# EAGLE design DVD (EAGLE 7.3.0)
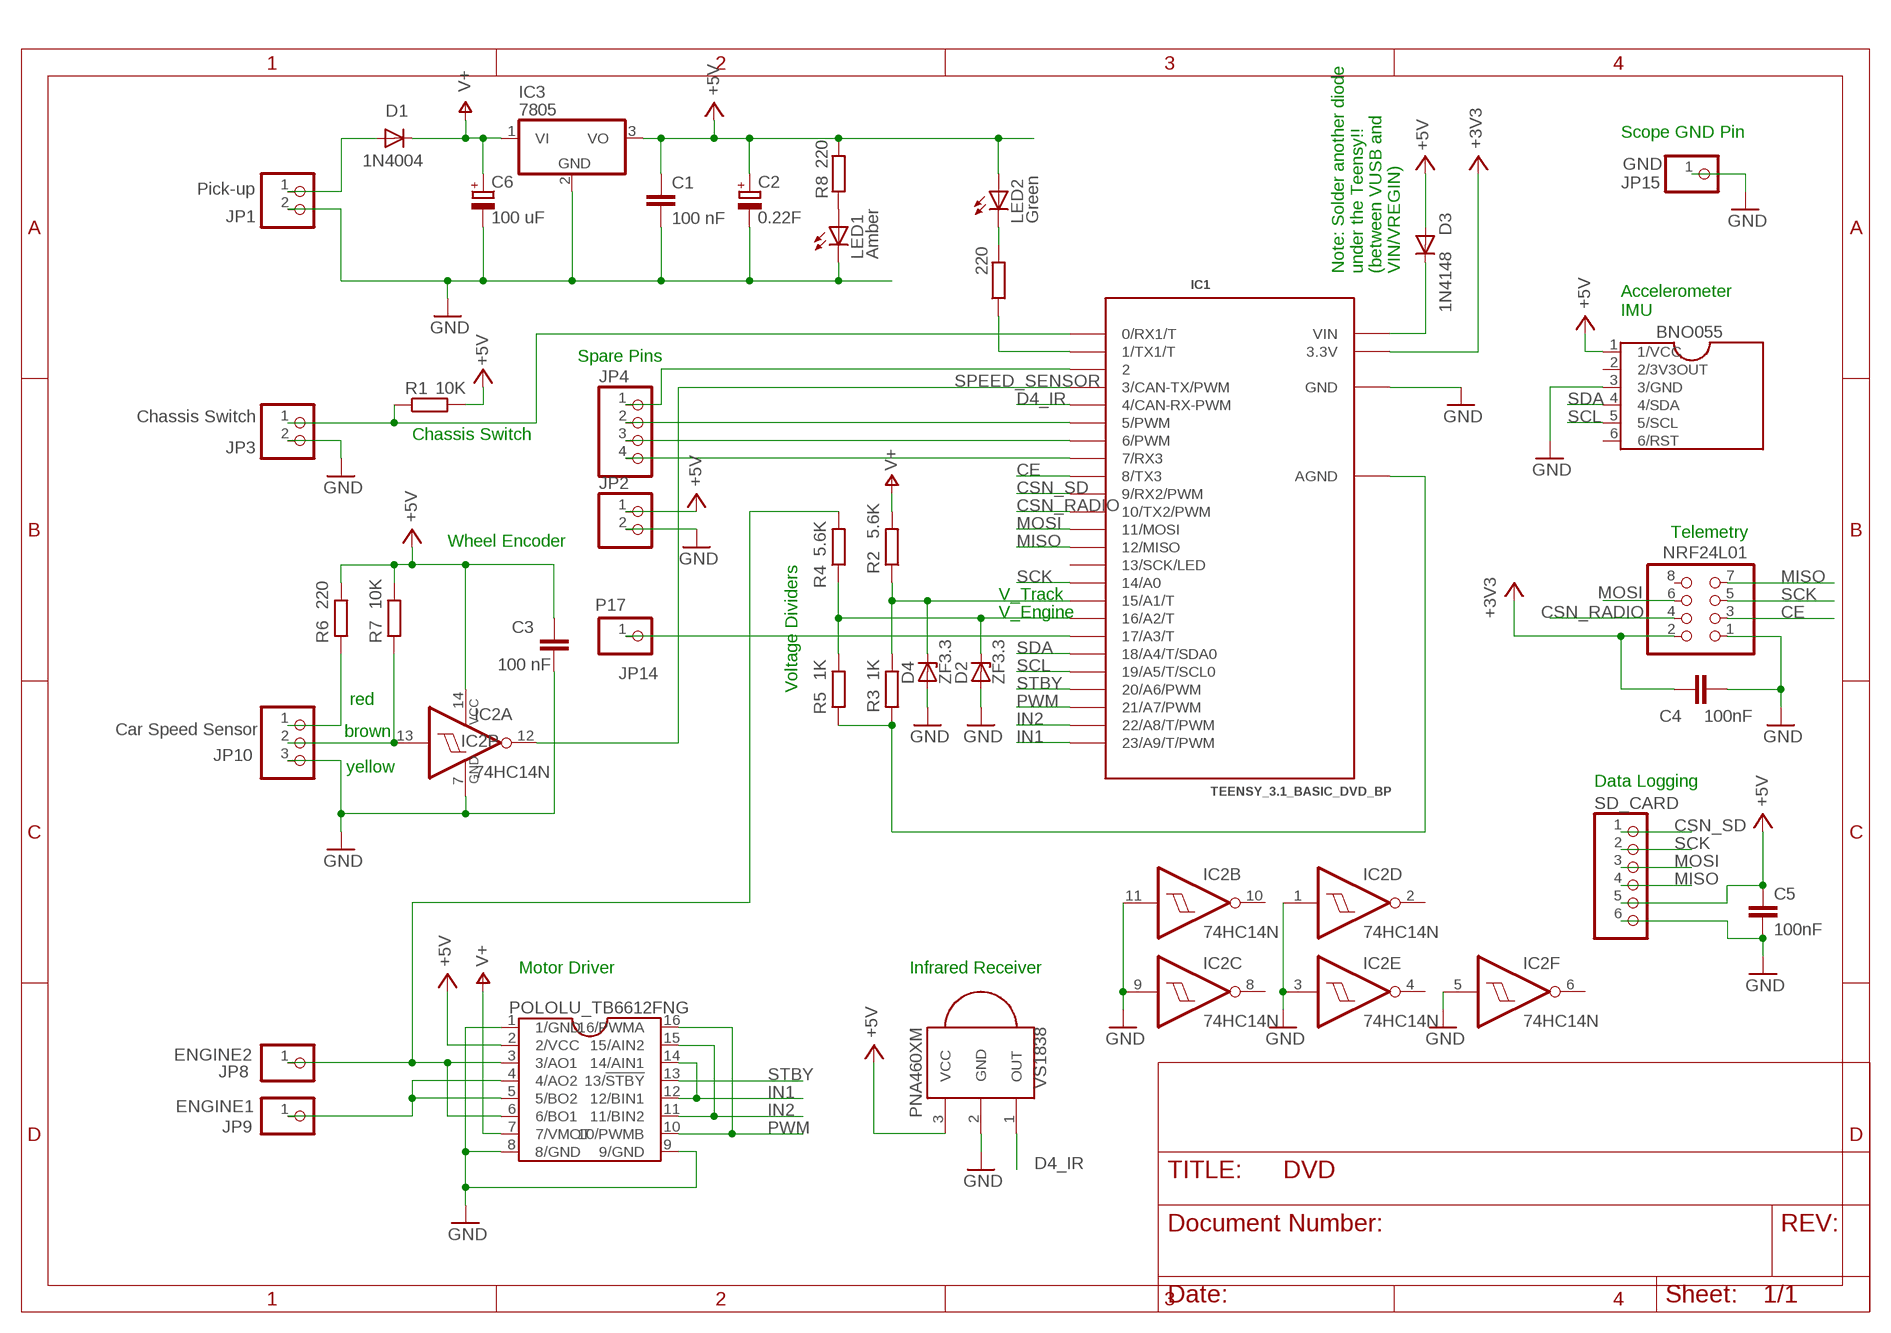
[diagram p0: schematic, sheet 1]

## Parts
BNO055  BNO055_LIGHT  [DIL12-6-0]
C1  100 nF  C-EU025-025X050  [C025-025X050]
C2  0.22F  CPOL-EUP128-50  [P128-50]
C3  100 nF  C-EU025-025X050  [C025-025X050]
C4  100nF  C-EU025-025X050  [C025-025X050]
C5  100nF  C-EU025-024X044  [C025-024X044]
C6  100 uF  CPOL-EUE2.5-6  [E2,5-6]
D1  1N4004  [DO41-10]
D2  ZF3.3  ZENER-DIODEZD-7.5  [ZDIO-7.5]
D3  1N4148  1N4004  [DO41-10]
D4  ZF3.3  ZENER-DIODEZD-7.5  [ZDIO-7.5]
IC1  TEENSY_3.1_BASIC_DVD_BP  [TEENSY_3.1_BASIC_DVD_BIGPADS]
IC2  74HC14N  [DIL14]
IC3  7805  786TV  [TO220V]
IC4  POLOLU_TB6612FNG  [DIL16WIDE]
JP1  Pick-up  PINHD-1X2  [1X02]
JP2  PINHD-1X2  [1X02]
JP3  Chassis Switch  PINHD-1X2  [1X02]
JP4  PINHD-1X4  [1X04]
JP8  ENGINE2  PINHD-1X1  [1X01]
JP9  ENGINE1  PINHD-1X1  [1X01]
JP10  Car Speed Sensor  PINHD-1X3  [1X03]
JP14  P17  PINHD-1X1  [1X01]
JP15  GND  PINHD-1X1  [1X01]
LED1  Amber  LED3MM  [LED3MM]
LED2  Green  LED3MM  [LED3MM]
NRF24L01  PINHD-2X4  [2X04]
R1  10K  R-EU_0207/10  [0207/10]
R2  5.6K  R-EU_0207/10  [0207/10]
R3  1K  R-EU_0207/10  [0207/10]
R4  5.6K  R-EU_0207/10  [0207/10]
R5  1K  R-EU_0207/10  [0207/10]
R6  220  R-EU_0207/10  [0207/10]
R7  10K  R-EU_0207/10  [0207/10]
R8  220  R-EU_0207/10  [0207/10]
R9  220  R-EU_0207/10  [0207/10]
SD_CARD  PINHD-1X6  [1X06]
VS1838  PNA460XM  [PNA460XM]

## Nets
+3V3: C4.1 IC1.3.3V NRF24L01.2
+5V: BNO055.1(1/VCC) C1.1 C2.+ C3.1 C5.1 D3.A IC2.14(P:VCC) IC3.3(VO) IC4.2(2/VCC) JP2.1 LED2.A R1.2 R6.2 R7.2 R8.2 SD_CARD.5 VS1838.3(VCC)
AGND: IC1.AGND R3.1 R5.1
CE: IC1.8(8/TX3) NRF24L01.3
CSN_RADIO: IC1.10(10/TX2/PWM) NRF24L01.4
CSN_SD: IC1.9(9/RX2/PWM) SD_CARD.1
D4_IR: IC1.4(4/CAN-RX-PWM) VS1838.1(OUT)
ENGINE1: IC4.4(4/AO2) IC4.5(5/BO2) JP9.1
GND: BNO055.3(3/GND) C1.2 C2.- C3.2 C4.2 C5.2 C6.- D2.A D4.A IC1.GND IC2.1(D:I) IC2.3(E:I) IC2.5(F:I) IC2.7(P:GND) IC2.9(C:I) IC2.11(B:I) IC3.2(GND) IC4.1(1/GND) IC4.8(8/GND) IC4.9(9/GND) JP1.2 JP2.2 JP3.2 JP10.3 JP15.1 LED1.K(C) NRF24L01.1 SD_CARD.6 VS1838.2(GND)
IN1: IC1.23/A9(23/A9/T/PWM) IC4.12(12/BIN1) IC4.14(14/AIN1)
IN2: IC1.22/A8(22/A8/T/PWM) IC4.11(11/BIN2) IC4.15(15/AIN2)
JP8: IC4.3(3/AO1) IC4.6(6/BO1) JP8.1 R4.2
MISO: IC1.12(12/MISO) NRF24L01.7 SD_CARD.4
MOSI: IC1.11(11/MOSI) NRF24L01.6 SD_CARD.3
N$1: D3.C IC1.VIN
N$2: JP10.1 R6.1
N$3: IC1.5(5/PWM) JP4.2
N$4: LED2.K(C) R9.2
N$6: IC1.17/A3(17/A3/T) JP14.1
N$7: LED1.A R8.1
N$10: D4.C IC1.15/A1(15/A1/T) R2.1 R3.2
N$11: D2.C IC1.16/A2(16/A2/T) R4.1 R5.2
N$18: IC1.0(0/RX1/T) JP3.1 R1.1
N$19: IC1.1(1/TX1/T) R9.1
N$20: IC1.2 JP4.1
N$21: IC1.6(6/PWM) JP4.3
N$22: IC1.7(7/RX3) JP4.4
N$26: IC2.13(A:I) JP10.2 R7.1
PICKUP_PLUS: D1.A JP1.1
PWM: IC1.21/A7(21/A7/PWM) IC4.10(10/PWMB) IC4.16(16/PWMA)
SCK: IC1.14/A0 NRF24L01.5 SD_CARD.2
SCL: BNO055.5(5/SCL) IC1.19/A5(19/A5/T/SCL0)
SDA: BNO055.4(4/SDA) IC1.18/A4(18/A4/T/SDA0)
SPEED_SENSOR: IC1.3(3/CAN-TX/PWM) IC2.12(A:O)
STBY: IC1.20/A6(20/A6/PWM) IC4.13(13/!STBY)
V+: C6.+ D1.C IC3.1(VI) IC4.7(7/VMOT) R2.2
Unconnected: BNO055.6(6/RST) IC1.13(13/SCK/LED) IC2.2(D:O) IC2.4(E:O) IC2.6(F:O) IC2.8(C:O) IC2.10(B:O) NRF24L01.8

## Notes on the sheet
- Scope GND Pin
- Note: Solder another diode
  under the Teensy!!
  (between VUSB and
  VIN/VREGIN)
- Accelerometer
  IMU
- Spare Pins
- Chassis Switch
- Telemetry
- Wheel Encoder
- Voltage Dividers
- V_Track
- V_Engine
- red
- brown
- yellow
- Data Logging
- Motor Driver | Infrared Receiver

## Power pins joined to a net without a drawn wire
2/3V3OUT: BNO055.2(2/3V3OUT)

## Library data of the parts
BNO055 = DVD:BNO055_LIGHT
C1 C3 C4 = resistor:C-EU: CAPACITOR, European symbol
C2 = resistor:CPOL-EU: POLARIZED CAPACITOR, European symbol
C5 = rcl:C-EU: CAPACITOR, European symbol
C6 = rcl:CPOL-EU: POLARIZED CAPACITOR, European symbol
D1 D3 = adafruit:1N4004: DIODE General purpose 1N400x type rectifier (With bigger pads) http://www.ladyada.net/library/pcb/eaglelibrary.html
D2 D4 = diode:ZENER-DIODE: Z-Diode
IC1 = Teensy_3_Series_Board_v1.0:TEENSY_3.1_BASIC_DVD_BP
IC2 = 74xx-eu:74*14: Hex schmitt trigger INVERTER
IC3 = linear:78*: Positive VOLTAGE REGULATOR Source: http://cache.national.com/ds/LM/LM78L05.pdf http://www.fairchildsemi.com/ds/LM/LM7805.pdf
IC4 = DVD:POLOLU_TB6612FNG
JP1-JP3 = pinhead:PINHD-1X2: PIN HEADER
JP4 = pinhead:PINHD-1X4: PIN HEADER
JP8 JP9 JP14 JP15 = pinhead:PINHD-1X1: PIN HEADER
JP10 = pinhead:PINHD-1X3: PIN HEADER
LED1 LED2 = adafruit:LED: LED OSRAM: - CHIPLED LG R971, LG N971, LY N971, LG Q971, LY Q971, LO R971, LY R971 LH N974, LH R974 LS Q976, LO Q976, LY Q976 LO Q996 - Hyper CHIPLED LW Q18S LB Q993, LB Q99A, LB R99A - SideLED LS A670, LO A670, LY A670, LG A670, LP A670 LB A673, LV A673, LT A673, LW A673 LH A674 LY A675 LS A676, LA A676, LO A676, LY A676, LW A676 LS A679, LY A679, LG A679 - Hyper Micro SIDELED® LS Y876, LA Y876, LO Y876, LY Y876 LT Y87S - SmartLED LW L88C, LW L88S LB L89C, LB L89S, LG L890 LS L89K, LO L89K, LY L89K LS L896, LA L896, LO L896, LY L896 - TOPLED LS T670, LO T670, LY T670, LG T670, LP T670 LSG T670, LSP T670, LSY T670, LOP T670, LYG T670 LG T671, LOG T671, LSG T671 LB T673, LV T673, LT T673, LW T673 LH T674 LS T676, LA T676, LO T676, LY T676, LB T676, LH T676, LSB T676, LW T676 LB T67C, LV T67C, LT T67C, LS T67K, LO T67K, LY T67K, LW E67C LS E67B, LA E67B, LO E67B, LY E67B, LB E67C, LV E67C, LT E67C LW T67C LS T679, LY T679, LG T679 LS T770, LO T770, LY T770, LG T770, LP T770 LB T773, LV T773, LT T773, LW T773 LH T774 LS E675, LA E675, LY E675, LS T675 LS T776, LA T776, LO T776, LY T776, LB T776 LHGB T686 LT T68C, LB T68C - Hyper Mini TOPLED® LB M676 - Mini TOPLED Santana® LG M470 LS M47K, LO M47K, LY M47K Source: http://www.osram.convergy.de/
NRF24L01 = adafruit:PINHD-2X4: PIN HEADER
R1-R9 = resistor:R-EU_: RESISTOR, European symbol
SD_CARD = adafruit:PINHD-1X6: PIN HEADER
VS1838 = adafruit:PNA460XM: IR 38KHz receiver PNA4602 and related receivers http://www.ladyada.net/library/pcb/eaglelibrary.html

## Net classes
0 default: width 0.254 mm

## Board
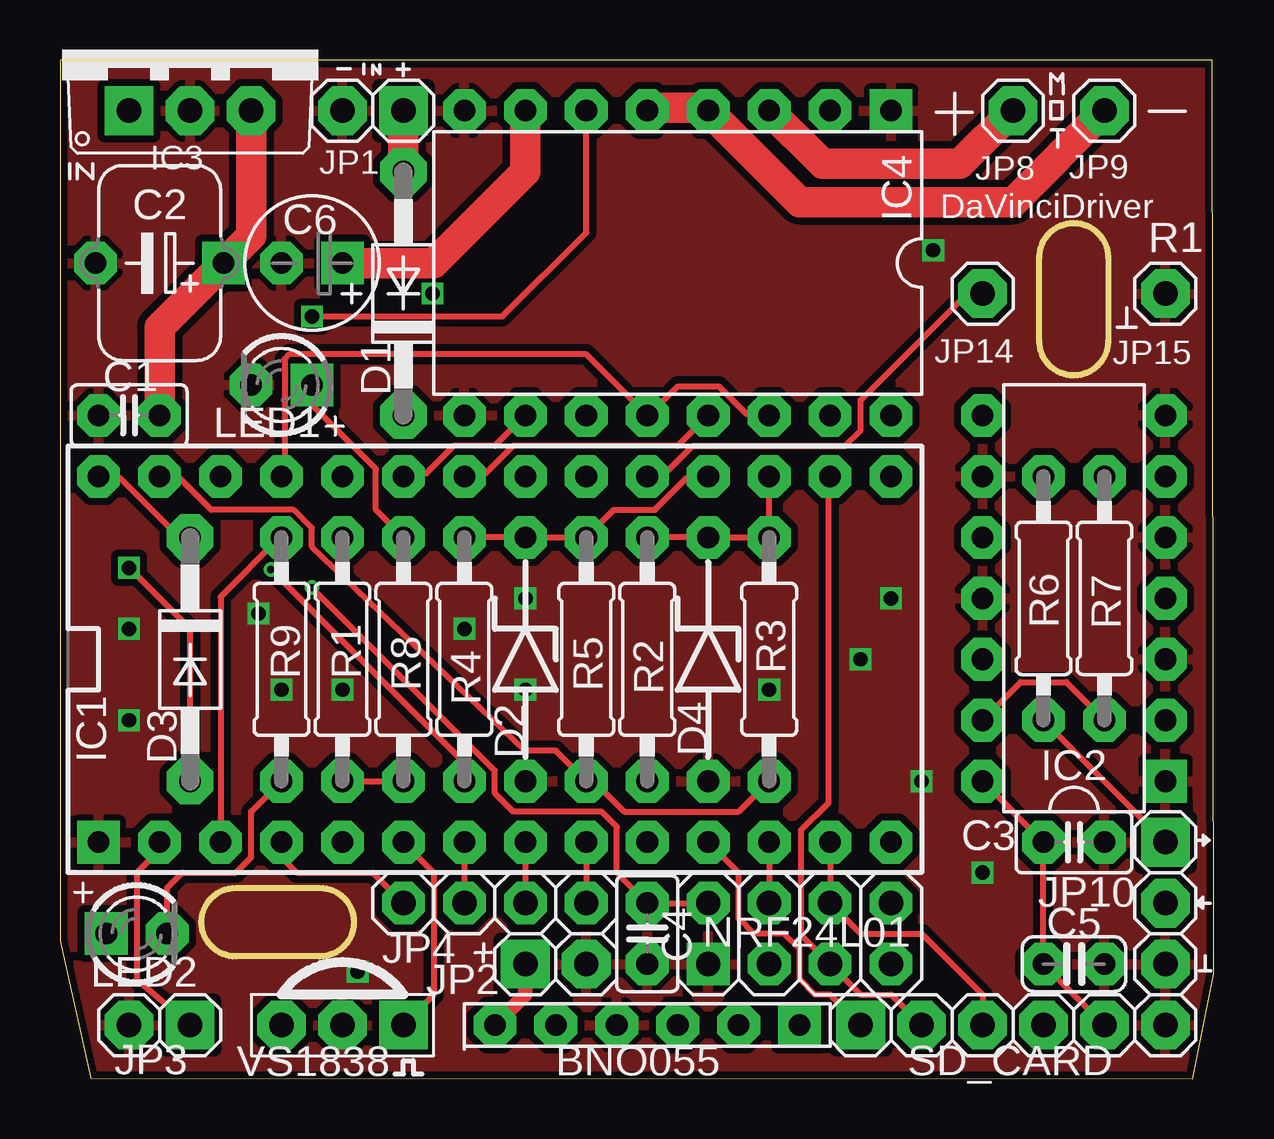
[diagram p1: board, top side]
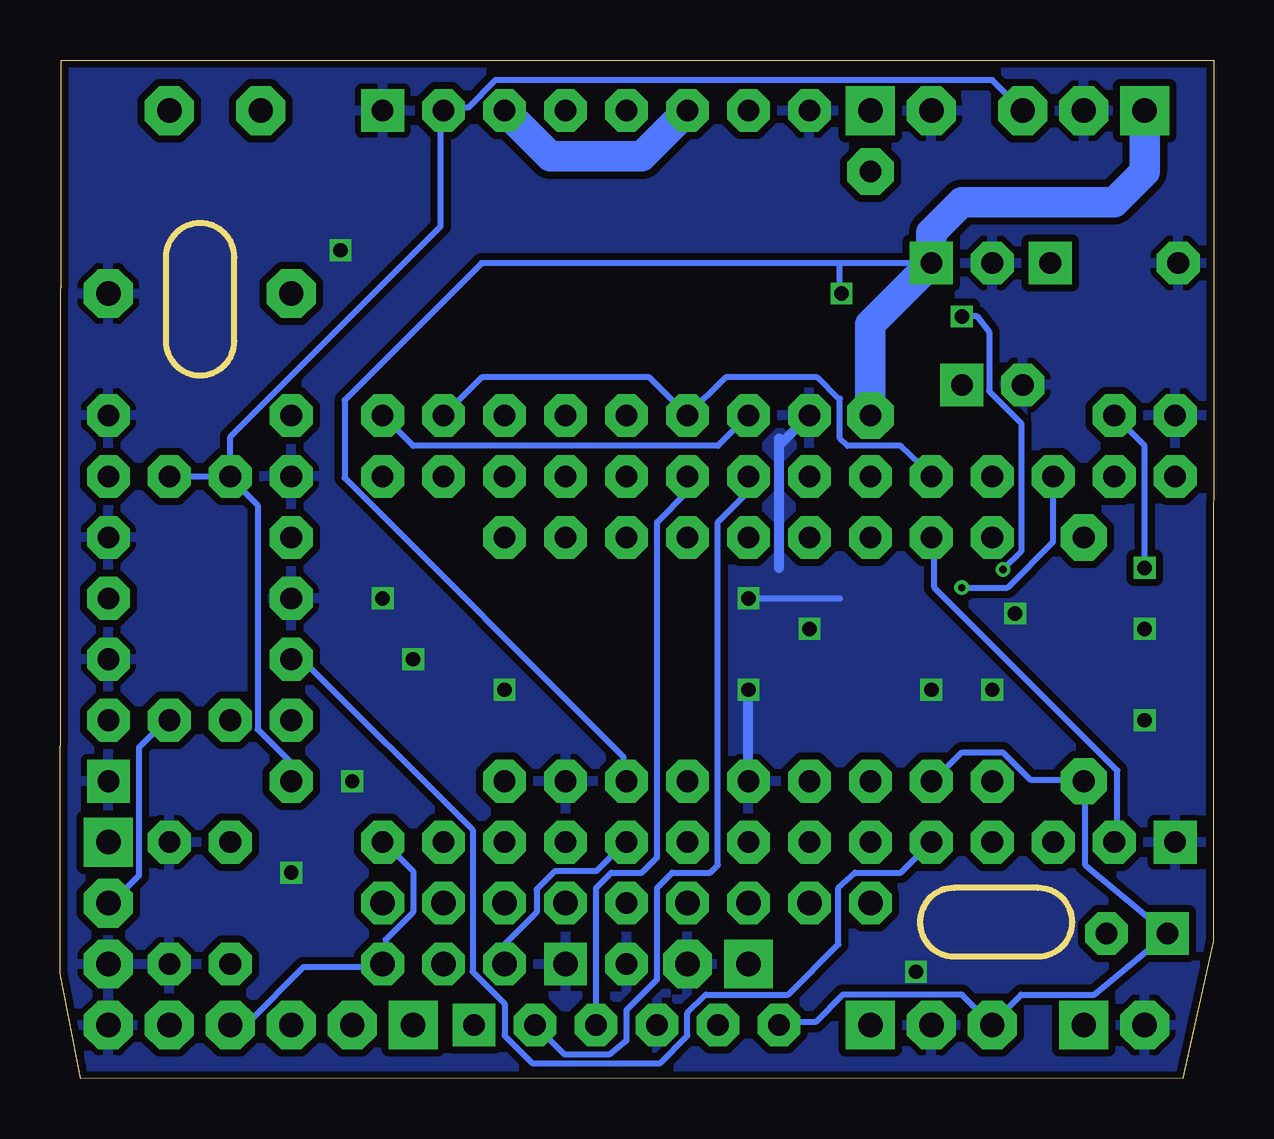
[diagram p2: board, bottom side, seen from below]

Size 48.07 x 42.45 mm. Coordinates in mm from the lower left corner, seen from the top.
Outline: 0.02,5.73 1.29,0.03 47.21,0 48.07,4.38 48.02,42.45 0,42.45 0.02,5.73
Copper layers (1*16): Top 0.035mm / dielectric 1.5mm / Bottom 0.035mm
Design rules "dirt_cheap_dirty_boards.v1": minimum track width 5mil, minimum drill 12mil, track to track 5mil, track to pad 5mil, pad to pad 5mil, via to via 5mil, smd to smd 0mil, copper to edge 10mil, drill to drill 10mil, minimum pad ring 10mil, minimum via ring 6mil, stop-mask expansion 2mil, vias tented up to drill 25mil, thermal gap 10mil
Milling: 8 lines

### Footprints (pad centres in the part's own frame; a part is rotated, then mirrored left to right if it is on the bottom)
DIL12-6-0 = drill 0.9 pad 1.778 octagon: 1 -6.35,0; 2 -3.81,0; 3 -1.27,0; 4 1.27,0; 5 3.81,0 | drill 0.9 pad 1.778 square: 6 6.35,0
C025-025X050 = drill 0.9 pad 1.778 octagon: 1 -1.27,0; 2 1.27,0
P128-50 = drill 0.9 pad 1.778 square: + -2.667,0 | drill 0.9 pad 1.778 octagon: - 2.667,0
C025-024X044 = drill 0.9 pad 1.778 octagon: 1 -1.27,0; 2 1.27,0
E2,5-6 = drill 0.9 pad 1.778 square: + -1.27,0 | drill 0.9 pad 1.778 octagon: - 1.27,0
DO41-10 = drill 0.9 pad 1.93 octagon: A 5.08,0; C -5.08,0
ZDIO-7.5 = drill 0.9 pad 1.778 octagon: A 5.08,0; C -5.08,0
TEENSY_3.1_BASIC_DVD_BIGPADS = drill 0.9 pad 1.778 octagon: 0 -7.62,13.97; 1 -7.62,11.43; 2 -7.62,8.89; 3 -7.62,6.35; 3.3V 7.62,11.43; 4 -7.62,3.81; 5 -7.62,1.27; 6 -7.62,-1.27; 7 -7.62,-3.81; 8 -7.62,-6.35; 9 -7.62,-8.89; 10 -7.62,-11.43; 11 -7.62,-13.97; 12 -7.62,-16.51; 13 7.62,-16.51; 14/A0 7.62,-13.97; 15/A1 7.62,-11.43; 16/A2 7.62,-8.89; 17/A3 7.62,-6.35; 18/A4 7.62,-3.81; 19/A5 7.62,-1.27; 20/A6 7.62,1.27; 21/A7 7.62,3.81; 22/A8 7.62,6.35; 23/A9 7.62,8.89; AGND 7.62,13.97; VIN 7.62,16.51 | drill 0.9 pad 1.778 square: GND -7.62,16.51
DIL14 = drill 0.9 pad 1.778 square: 1 -7.62,-3.81 | drill 0.9 pad 1.778 octagon: 2 -5.08,-3.81; 3 -2.54,-3.81; 4 0,-3.81; 5 2.54,-3.81; 6 5.08,-3.81; 7 7.62,-3.81; 8 7.62,3.81; 9 5.08,3.81; 10 2.54,3.81; 11 0,3.81; 12 -2.54,3.81; 13 -5.08,3.81; 14 -7.62,3.81
TO220V = drill 1.016 pad 2.032 square: 1 -2.54,-2.54 | drill 1.016 pad 2.032 octagon: 2 0,-2.54; 3 2.54,-2.54
DIL16WIDE = drill 0.9 pad 1.778 square: 1 -7.62,-6.35 | drill 0.9 pad 1.778 octagon: 2 -5.08,-6.35; 3 -2.54,-6.35; 4 0,-6.35; 5 2.54,-6.35; 6 5.08,-6.35; 7 7.62,-6.35; 8 10.16,-6.35; 9 10.16,6.35; 10 7.62,6.35; 11 5.08,6.35; 12 2.54,6.35; 13 0,6.35; 14 -2.54,6.35; 15 -5.08,6.35; 16 -7.62,6.35
1X02 = drill 1.016 pad 2.032 square: 1 -1.27,0 | drill 1.016 pad 2.032 octagon: 2 1.27,0
1X04 = drill 1.016 pad 1.778 octagon: 1 -3.81,0; 2 -1.27,0; 3 1.27,0; 4 3.81,0
1X01 = drill 1.016 pad 2.032 octagon: 1 0,0
1X03 = drill 1.016 pad 2.032 square: 1 -2.54,0 | drill 1.016 pad 2.032 octagon: 2 0,0; 3 2.54,0
LED3MM = drill 0.9 pad 1.778 square: A -1.27,0 | drill 0.9 pad 1.778 octagon: K 1.27,0
2X04 = drill 1.016 pad 1.778 square: 1 -3.81,-1.27 | drill 1.016 pad 1.778 octagon: 2 -3.81,1.27; 3 -1.27,-1.27; 4 -1.27,1.27; 5 1.27,-1.27; 6 1.27,1.27; 7 3.81,-1.27; 8 3.81,1.27
0207/10 = drill 0.9 pad 1.778 octagon: 1 -5.08,0; 2 5.08,0
1X06 = drill 1.016 pad 2.032 square: 1 -6.35,0 | drill 1.016 pad 2.032 octagon: 2 -3.81,0; 3 -1.27,0; 4 1.27,0; 5 3.81,0; 6 6.35,0
PNA460XM = drill 1.016 pad 2.032 square: 1 -2.54,0 | drill 1.016 pad 2.032 octagon: 2 0,0; 3 2.54,0

### Placement (x,y rotation side)
BNO055  24.47,2.24 0 top
C1  2.88,27.64 180 top
C2  4.15,33.99 180 top
C3  42.25,9.86 0 top
C4  24.47,6.05 270 top
C5  42.25,4.78 0 top
C6  10.5,33.99 180 top
D1  14.31,32.72 90 top
D2  19.39,17.48 270 top
D3  5.42,17.48 270 top
D4  27.01,17.48 270 top
IC1  18.12,17.48 90 top
IC2  42.25,20.02 90 top
IC3  5.42,42.88 0 top
IC4  27.01,33.99 180 top
JP1  13.04,40.34 180 top
JP2  20.66,4.78 0 top
JP3  4.15,2.24 180 top
JP4  18.12,7.32 0 top
JP8  39.71,40.34 0 top
JP9  43.52,40.34 0 top
JP10  46.06,7.32 270 top
JP14  38.44,32.72 0 top
JP15  46.06,32.72 0 top
LED1  9.23,28.91 180 top
LED2  3.2,6.05 0 top
NRF24L01  30.82,6.05 0 top
R1  11.77,17.48 270 top
R2  24.47,17.48 270 top
R3  29.55,17.48 90 top
R4  16.85,17.48 270 top
R5  21.93,17.48 90 top
R6  40.98,20.02 90 top
R7  43.52,20.02 90 top
R8  14.31,17.48 270 top
R9  9.23,17.48 270 top
SD_CARD  39.71,2.24 0 top
VS1838  11.77,2.24 180 top

### Tracks (layer width: path | path; a pad name or v marks a point on that pad's centre or on a via)
+3V3  (via drill 0.3)
  Top 0.254: v10.5,20.46 18.12,12.84 18.12,11.89 18.88,11.13 22.56,11.13 23.2,10.49 23.2,8.59 24.41,7.32 C4.1 NRF24L01.2
  Bottom 0.254: IC1.3.3V 6.69,22.37 8.59,20.46 v10.5,20.46
+5V  (via drill 0.6)
  Top 0.254: R1.2 R8.2 | IC2.14 C3.1 C5.1 SD_CARD.5 | 4.02,30.12 4.09,28.91 C1.1 | D3.A 5.42,18.75 v2.88,21.29
  Top 0.61: JP2.1 19.39,3.51 BNO055.1
  Top 1.27: IC3.3 7.96,35.13 C2.+ 4.15,31.32 C1.1
  Bottom 0.254: R6.2 40.98,26.75 32.22,35.51 32.22,40.28 IC4.2 32.03,40.47 31.07,40.47 29.93,41.61 9.23,41.61 IC3.3 | IC2.14 38.5,12.46 38.5,13.22 39.84,14.56 39.84,23.89 40.98,25.04 R6.2 | R1.2 11.64,12.46 10.5,13.61 8.78,13.61 7.64,12.46 5.55,12.46 D3.A 5.36,12.27 5.36,8.91 LED2.A 4.98,3.51 8.02,3.51 9.17,2.37 VS1838.3 10.5,3.51 15.45,3.51 16.6,2.37 18.12,2.37 BNO055.1 | R7.2 R6.2 | v2.88,21.29 2.88,26.37 C1.1
AGND
  Top 0.254: IC1.AGND 4.21,25.04 4.98,25.04 6.31,23.7 9.74,23.7 10.5,22.94 10.5,22.18 19.39,13.67 20.66,13.67 R5.1 22.25,12.4 23.52,11.13 28.28,11.13 R3.1
CE
  Bottom 0.254: NRF24L01.3 29.55,5.6 28.22,6.94 28.22,7.89 27.45,8.65 25.74,8.65 24.6,9.8 IC1.8
CSN_RADIO
  Top 0.254: IC1.10 NRF24L01.4
CSN_SD
  Top 0.254: SD_CARD.1 32.09,3.51 31.45,3.51 30.82,4.14 30.82,5.41 30.18,6.05 28.91,6.05 28.28,6.68 28.28,8.59 IC1.9
D4_IR
  Top 0.254: IC1.4 15.58,8.59 15.58,3.51 VS1838.1
ENGINE1
  Top 0.254: 26.88,40.47 IC4.4
  Top 1.27: 26.88,40.47 24.6,40.47 IC4.5 | IC4.4 30.82,36.53 39.71,36.53 JP9.1
GND  (via drill 0.6)
  Bottom 0.254: v19.39,20.02 15.58,20.02
  Bottom 0.406: IC4.9 18.12,26.37 | D2.A v19.39,16.21 | 18.12,26.69 18.12,26.37 | 18.12,26.37 18.12,21.29
  other vias: 29.55,16.21 2.88,18.75 2.88,14.94 9.23,16.21 11.77,16.21 16.85,18.75 33.36,17.48 34.63,20.02 35.9,12.4 38.44,8.59 36.38,34.52 12.4,4.46 8.28,19.38
  pour Top (isolate 0.305): -0.51,43.04 48.09,42.45 48,42.2 48,0.04 -0.08,0.04 -0.51,0.63
  pour Bottom (isolate 0.305): 0.08,42.45 48,42.45 48,42.2 47.92,42.2 47.92,0.04 -0.42,-0.22 -0.42,42.03
IN1
  Top 0.254: IC1.23/A9 9.36,25.23 9.36,29.99 9.55,30.18 21.93,30.18 IC4.12 24.6,27.7 25.74,28.85 27.45,28.85 28.6,27.7 29.55,27.7 IC4.14
IN2
  Bottom 0.254: IC4.15 30.5,29.23 23.52,29.23 IC4.11 20.34,29.23 16.53,29.23 15.64,28.34 15.58,28.34 15.58,26.69 15.26,26.37 13.04,26.37 11.83,25.23 11.77,25.16 IC1.22/A8
JP8  (via drill 0.3, 0.6)
  Top 0.254: v8.78,21.23 16.79,13.22 16.79,12.46 R4.2 | v10.5,31.77 18.44,31.77 21.93,35.26 IC4.6
  Top 1.27: JP8.1 37.49,38.12 31.77,38.12 IC4.3
  Bottom 0.254: v8.78,21.23 8.02,21.99 8.02,27.32 9.36,28.66 9.36,31.13 9.86,31.77 v10.5,31.77 | 21.93,40.28 IC4.6
  Bottom 1.27: IC4.3 27.64,38.43 23.83,38.43 IC4.6
MISO
  Bottom 0.254: IC1.12 34.5,9.8 33.36,8.65 33.36,6.94 34.5,5.8 34.5,4.84 NRF24L01.7 34.69,4.65 37.93,4.65 40.22,2.37 40.98,2.37 SD_CARD.4
MOSI
  Top 0.254: IC1.11 NRF24L01.6 33.36,6.05 35.9,6.05 38.44,3.51 SD_CARD.3
N$1
  Top 0.254: D3.C 4.98,22.56 2.5,25.04 1.74,25.04 IC1.VIN
N$2
  Top 0.254: JP10.1 R6.1
N$3
  Top 0.254: IC1.5 JP4.2
N$4
  Top 0.254: LED2.K 4.47,7.95 5.1,8.59 7.32,8.59 7.96,9.22 7.96,11.13 R9.2
N$6
  Top 0.254: IC1.17/A3 25.1,25.1 26.37,26.37 32.72,26.37 33.36,27 33.36,28.27 37.8,32.72 JP14.1
N$7
  Top 0.254: LED1.A 10.5,28.08 13.17,25.42 13.17,23.7 R8.1
N$10
  Top 0.254: R2.1 D4.C R3.2 IC1.15/A1
N$11
  Top 0.254: R4.1 D2.C R5.2 23.07,23.7 24.79,23.7 26.12,25.04 26.88,25.04 IC1.16/A2
N$18
  Top 0.254: IC1.0 4.15,9.54 3.2,8.59 3.2,4.14 JP3.1
  Bottom 0.254: R1.1 11.64,22.56 11.64,20.46 4.02,12.84 4.02,9.99 IC1.0
N$19
  Top 0.254: IC1.1 6.69,20.08 9.17,22.56 R9.1
N$20
  Top 0.254: IC1.2 9.23,9.22 9.86,8.59 13.04,8.59 JP4.1
N$21
  Top 0.254: IC1.6 JP4.3
N$22
  Top 0.254: IC1.7 JP4.4
N$26
  Top 0.254: IC2.13 40.03,16.53 41.93,16.53 R7.1
  Bottom 0.254: JP10.2 45.93,7.32 44.79,8.46 44.79,13.8 43.65,14.94 R7.1
PICKUP_PLUS
  Top 1.27: JP1.1 D1.A
PWM
  Top 0.254: IC4.10 18.12,26.37 16.4,26.37 15.26,25.23 14.31,25.23 IC1.21/A7
  Bottom 0.254: IC4.10 20.66,26.37 33.36,26.37 IC4.16
SCK
  Top 0.254: IC1.14/A0 32.03,25.04 32.03,11.51 30.88,10.37 30.88,5.99 NRF24L01.5 33.36,3.51 34.63,3.51 SD_CARD.2
SCL
  Bottom 0.254: IC1.19/A5 19.39,24.46 20.66,23.19 20.66,8.91 20.98,8.59 22.56,8.59 23.2,7.95 23.2,4.14 24.47,2.87 24.47,1.6 25.17,1.03 27.07,1.03 BNO055.5
SDA
  Bottom 0.254: IC1.18/A4 21.93,24.46 23.2,23.19 23.2,9.22 23.83,8.59 25.1,8.59 25.74,7.95 BNO055.4
SPEED_SENSOR
  Bottom 0.254: IC2.12 38.31,17.42 37.93,17.42 30.88,10.37 30.88,4.46 29.55,3.13 29.55,1.79 28.41,0.65 23.07,0.65 21.93,1.79 21.93,2.75 21.17,3.51 17.74,3.51 15.64,5.6 15.64,7.95 14.94,8.59 13.04,8.59 IC1.3
STBY
  Top 0.254: IC4.13 25.74,26.37 18.88,26.37 17.74,25.23 16.98,25.23 IC1.20/A6
V+  (via drill 0.6)
  Top 1.27: C6.+ 15.58,33.99 19.39,37.8 IC4.7
  Bottom 0.254: C6.+ 15.58,33.99 | 15.58,33.99 30.5,33.99 36.22,28.27 36.22,25.04 24.6,13.42 24.6,12.46 R2.2 | v15.52,32.72 15.58,32.78 15.58,33.99
  Bottom 1.27: IC3.1 2.88,37.8 4.15,36.53 10.5,36.53 11.77,35.26 C6.+ 14.31,31.45 D1.C

### Text on the board
tNames: DaVinciDriver | R1